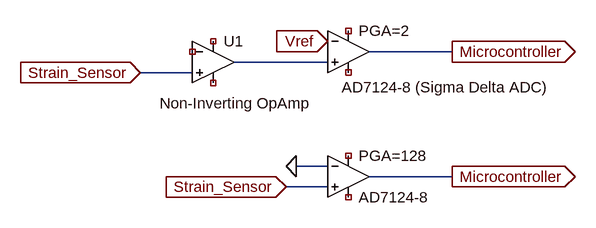
[diagram p0: schematic Camera Circuit Bentley Grant.asc]
Camera Circuit Bentley Grant.asc, the LTspice schematic file:
Version 4.1
SHEET 1 1332 680
WIRE 928 144 800 144
WIRE 736 160 592 160
WIRE 528 176 448 176
WIRE 736 320 688 320
WIRE 928 336 800 336
WIRE 736 352 672 352
FLAG 736 128 Vref
IOPIN 736 128 In
FLAG 928 144 Microcontroller
IOPIN 928 144 Out
FLAG 448 176 Strain_Sensor
IOPIN 448 176 In
FLAG 928 336 Microcontroller
IOPIN 928 336 Out
FLAG 672 352 Strain_Sensor
IOPIN 672 352 In
FLAG 688 320 0
SYMBOL OpAmps\\opamp2 560 96 R0
WINDOW 3 -82 127 Left 2
SYMATTR InstName U1
SYMATTR Value Non-Inverting OpAmp
SYMBOL OpAmps\\opamp2 768 80 R0
WINDOW 3 -10 119 Left 2
SYMATTR InstName PGA=2
SYMATTR Value AD7124-8 (Sigma Delta ADC)
SYMBOL OpAmps\\opamp2 768 272 R0
SYMATTR InstName PGA=128
SYMATTR Value AD7124-8

The netlist it stands for:
* Camera Circuit Bentley Grant.asc
X§U1 Strain_Sensor NC_01 NC_02 NC_03 N001 Non-Inverting OpAmp  ; pins In+ In- V+ V- OUT
X§PGA=2 N001 Vref NC_04 NC_05 Microcontroller AD7124-8 (Sigma Delta ADC)  ; pins In+ In- V+ V- OUT
X§PGA=128 Strain_Sensor 0 NC_06 NC_07 Microcontroller AD7124-8  ; pins In+ In- V+ V- OUT
.backanno
.end